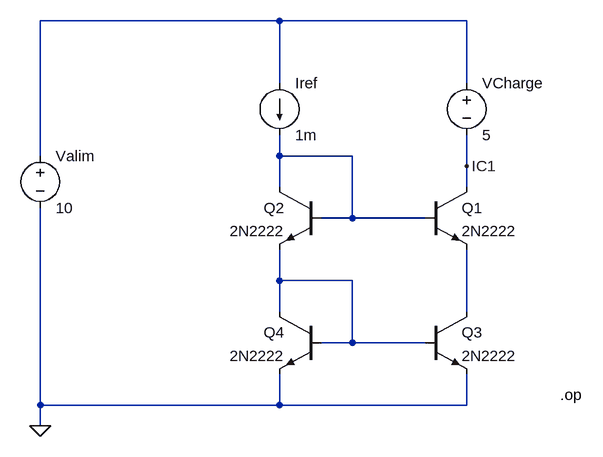
[diagram p0: schematic Miroir_courant_effet early.asc]
Miroir_courant_effet early.asc, the LTspice schematic file:
Version 4
SHEET 1 1072 680
WIRE 496 -96 128 -96
WIRE 784 -96 496 -96
WIRE 496 0 496 -96
WIRE 784 0 784 -96
WIRE 128 112 128 -96
WIRE 496 112 496 80
WIRE 608 112 496 112
WIRE 784 128 784 80
WIRE 496 160 496 112
WIRE 784 160 784 128
WIRE 608 208 608 112
WIRE 608 208 560 208
WIRE 720 208 608 208
WIRE 496 304 496 256
WIRE 608 304 496 304
WIRE 496 352 496 304
WIRE 784 352 784 256
WIRE 608 400 608 304
WIRE 608 400 560 400
WIRE 720 400 608 400
WIRE 128 496 128 192
WIRE 496 496 496 448
WIRE 496 496 128 496
WIRE 784 496 784 448
WIRE 784 496 496 496
WIRE 128 528 128 496
FLAG 128 528 0
FLAG 784 128 IC1
SYMBOL current 496 0 R0
WINDOW 123 0 0 Left 0
WINDOW 39 0 0 Left 0
SYMATTR InstName Iref
SYMATTR Value 1m
SYMBOL npn 720 160 R0
SYMATTR InstName Q1
SYMATTR Value 2N2222
SYMBOL npn 560 160 M0
SYMATTR InstName Q2
SYMATTR Value 2N2222
SYMBOL voltage 128 96 R0
WINDOW 123 0 0 Left 0
WINDOW 39 0 0 Left 0
SYMATTR InstName Valim
SYMATTR Value 10
SYMBOL voltage 784 -16 R0
WINDOW 123 0 0 Left 0
WINDOW 39 0 0 Left 0
SYMATTR InstName VCharge
SYMATTR Value 5
SYMBOL npn 720 352 R0
SYMATTR InstName Q3
SYMATTR Value 2N2222
SYMBOL npn 560 352 M0
SYMATTR InstName Q4
SYMATTR Value 2N2222
TEXT 928 480 Left 2 !.op

The netlist it stands for:
* Miroir_courant_effet early.asc
Iref N001 N002 1m
Q1 IC1 N002 N004 0 2N2222
Q2 N002 N002 N003 0 2N2222
Valim N001 0 10
VCharge N001 IC1 5
Q3 N004 N003 0 0 2N2222
Q4 N003 N003 0 0 2N2222
.model NPN NPN
.model PNP PNP
.lib standard.bjt
.op
.backanno
.end